# EAGLE schematic CubeSat_Power_Supply_Mk_3 (EAGLE 9.7.0)
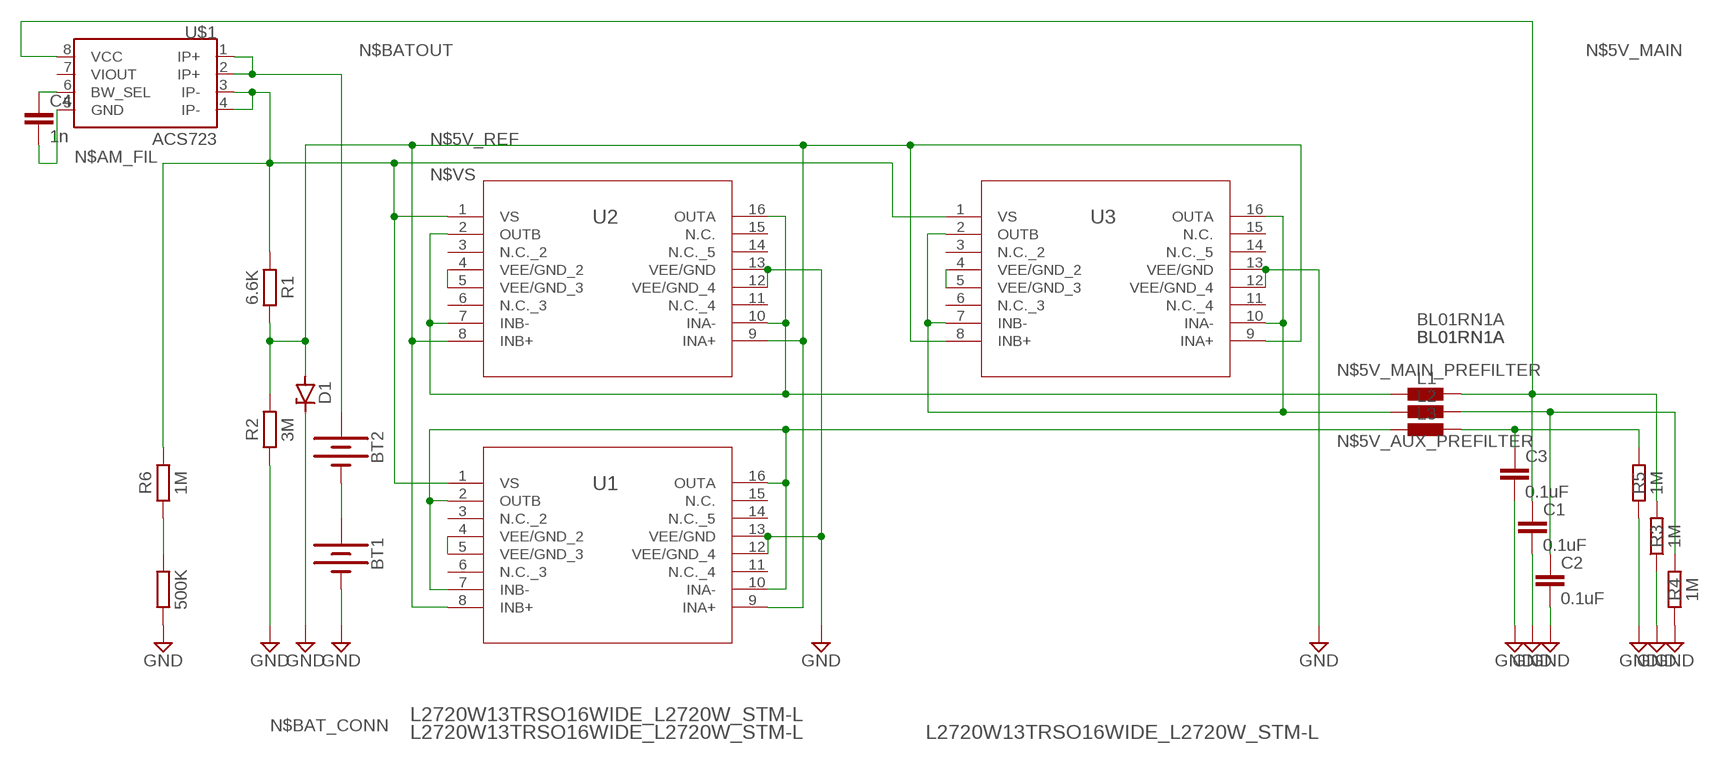
[diagram p0: schematic, sheet 1]

## Parts
BT1  BATTERY-18650  [BATTERY_18650-HOLDER]
BT2  BATTERY-18650  [BATTERY_18650-HOLDER]
C1  0.1uF  0.1UF-KIT-EZ-50V-20%  [CAP-PTH-SMALL-KIT]
C2  0.1uF  0.1UF-KIT-EZ-50V-20%  [CAP-PTH-SMALL-KIT]
C3  0.1uF  0.1UF-KIT-EZ-50V-20%  [CAP-PTH-SMALL-KIT]
C4  1n  0.1UF-KIT-EZ-50V-20%  [CAP-PTH-SMALL-KIT]
D1  ZENER-DIODESOT23  [SOT23]
L1  BL01RN1A  [BL01RN1A]
L2  BL01RN1A  [BL01RN1A]
L3  BL01RN1A  [BL01RN1A]
R1  6.6K  R_AXIAL-7.2MM-PITCH  [RESAD724W46L381D178B]
R2  3M  R_AXIAL-7.2MM-PITCH  [RESAD724W46L381D178B]
R3  1M  R_AXIAL-7.2MM-PITCH  [RESAD724W46L381D178B]
R4  1M  R_AXIAL-7.2MM-PITCH  [RESAD724W46L381D178B]
R5  1M  R_AXIAL-7.2MM-PITCH  [RESAD724W46L381D178B]
R6  1M  R_AXIAL-7.2MM-PITCH  [RESAD724W46L381D178B]
R7  500K  R_AXIAL-7.2MM-PITCH  [RESAD724W46L381D178B]
U1  L2720W13TRSO16WIDE_L2720W_STM-L  [SO16WIDE_L2720W_STM-L]
U2  L2720W13TRSO16WIDE_L2720W_STM-L  [SO16WIDE_L2720W_STM-L]
U3  L2720W13TRSO16WIDE_L2720W_STM-L  [SO16WIDE_L2720W_STM-L]
U$1  ACS723  [SO08]

## Nets
GND: BT1.GND@1(-) C1.2 C2.2 C3.2 D1.3(C) R2.1 R3.1 R4.1 R5.1 R7.1 U1.12(VEE/GND_4) U1.13(VEE/GND) U2.12(VEE/GND_4) U2.13(VEE/GND) U3.12(VEE/GND_4) U3.13(VEE/GND)
N$1: U2.4(VEE/GND_2) U2.5(VEE/GND_3)
N$2: U1.4(VEE/GND_2) U1.5(VEE/GND_3)
N$3: U3.4(VEE/GND_2) U3.5(VEE/GND_3)
N$4: L3.1 U1.2(OUTB) U1.7(INB-) U1.10(INA-) U1.16(OUTA)
N$5: C3.1 L3.2 R5.2
N$5V_AUX: C2.1 L2.2 R4.2
N$5V_AUX_PREFILTER: L2.1 U3.2(OUTB) U3.7(INB-) U3.10(INA-) U3.16(OUTA)
N$5V_MAIN: C1.1 L1.2 R3.2 U$1.8(VCC)
N$5V_MAIN_PREFILTER: L1.1 U2.2(OUTB) U2.7(INB-) U2.10(INA-) U2.16(OUTA)
N$5V_REF: D1.1(A) R1.2 R2.2 U1.8(INB+) U1.9(INA+) U2.8(INB+) U2.9(INA+) U3.8(INB+) U3.9(INA+)
N$11: C4.2 U$1.5(GND)
N$AM_FIL: C4.1 U$1.6(BW_SEL)
N$BAT_CONN: BT1.PWR@1(+) BT2.GND@1(-)
N$BATOUT: BT2.PWR@1(+) U$1.1(IP+) U$1.2(IP+)
N$VMSUP: R6.1 R7.2
N$VS: R1.1 R6.2 U1.1(VS) U2.1(VS) U3.1(VS) U$1.3(IP-) U$1.4(IP-)
Unconnected: U1.3(N.C._2) U1.6(N.C._3) U1.11(N.C._4) U1.14(N.C._5) U1.15(N.C.) U2.3(N.C._2) U2.6(N.C._3) U2.11(N.C._4) U2.14(N.C._5) U2.15(N.C.) U3.3(N.C._2) U3.6(N.C._3) U3.11(N.C._4) U3.14(N.C._5) U3.15(N.C.) U$1.7(VIOUT)

## Library data of the parts
BT1 BT2 = SparkFun-Batteries:BATTERY: Battery - Single Cell A variety of battery chemistries, sizes, and footprints. Device List: 20MM_PTH - Coin Cell Battery Holder - 20mm (PTH) <https://www.sparkfun.com/products/783> 20MM_PTH_KIT- Coin Cell battery Holder - 20 mm (PTH) <http://www.sparkfun.com/products/783>kit version with special mask 6.8MM_PTH - Coin Cell Battery Holder - 6.8MM(SMD) <https://www.digikey.com/product-detail/en/seiko-instruments/MS621FE-FL11E/728-1057-ND/1889208?WT.srch=1&gclid=CNOQ5a6LzdQCFZS2wAodXCkE0g> 12MM_SMD - Coin Cell Battery Holder - 12mm (SMD) <https://www.sparkfun.com/products/10592> 12MM_PTH - Coin Cell Battery Holder - 12mm (PTH) <https://www.sparkfun.com/products/7948> 20MM_SMD - 20mm Coin Cell Battery Holder (SMD) (2 legs) Used on the Big Time Watch Kit <https://www.sparkfun.com/products/11734> 20MM_SMD_4LEGS - Coin Cell Battery Holder - 20mm (SMD) <https://www.sparkfun.com/products/11892> 20MM_SMD_4LEGS_OVERPASTE - Coin Cell Battery Holder - 20mm (SMD) <https://www.sparkfun.com/products/11892> (Over-paste on the legs) 24.5MM_PTH - Coin Cell Battery Holder - 24.5mm (PTH) <https://www.sparkfun.com/products/8863> 9V - 9V Battery Holder - PC Mount Used on the SparkFun SparkPunk Sound Kit <https://www.sparkfun.com/products/11177> and SparkFun SparkPunk Sequencer Kit <https://www.sparkfun.com/products/12707> 18650 - Battery Holder - 18650 (PTH) <https://www.sparkfun.com/products/13113> AA - Battery Holder - 1xAA (PTH) <https://www.sparkfun.com/products/7949> AAA - Battery Holder - 1xAAA (PTH) <https://www.sparkfun.com/products/12718> AA_KIT - Battery Holder - 1xAA (PTH) <https://www.sparkfun.com/products/7949> Special kit package - pads only have exposed copper on one side of the board. AAA_KIT - Battery Holder - 1xAAA (PTH) <https://www.sparkfun.com/products/12718> Special kit package - pads only have exposed copper on one side of the board.; PROD_ID: BATT-12327; SF_SKU: PRT-13113
C1-C3 = SparkFun-Capacitors:0.1UF: 0.1µF ceramic capacitors A capacitor is a passive two-terminal electrical component used to store electrical energy temporarily in an electric field.; PROD_ID: CAP-08370
C4 = SparkFun-Capacitors:0.1UF: 0.1µF ceramic capacitors A capacitor is a passive two-terminal electrical component used to store electrical energy temporarily in an electric field.; PROD_ID: CAP-08370; VALUE: 0.1uF
D1 = diode:ZENER-DIODE: Z-Diode
L1-L3 = inductors:BL0: Noise Suppression Products/EMI Suppression Filters, Lead EMIFIL(R) Inductor Type Source: http://www.murata.com .. BL01RN1_DS.pdf
R1-R7 = Resistor:R: Resistor Fixed - Generic; CATEGORY: Resistor; SUB-CATEGORY: Fixed
U1-U3 = STM L2720W13TR:L2720W13TR; COPYRIGHT: Copyright (C) 2024 Ultra Librarian. All rights reserved.; MANUFACTURER_PART_NUMBER: L2720W13TR; MFR_NAME: STMicroelectronics
U$1 = SparkFun-Sensors:ACS723; PART_#: ACS723ACS723LLCTR-05AB-T2; PROD_ID: IC-13872